# Altium schematic sheet PiModulos V2 - Mayonaise.SchDoc
size B
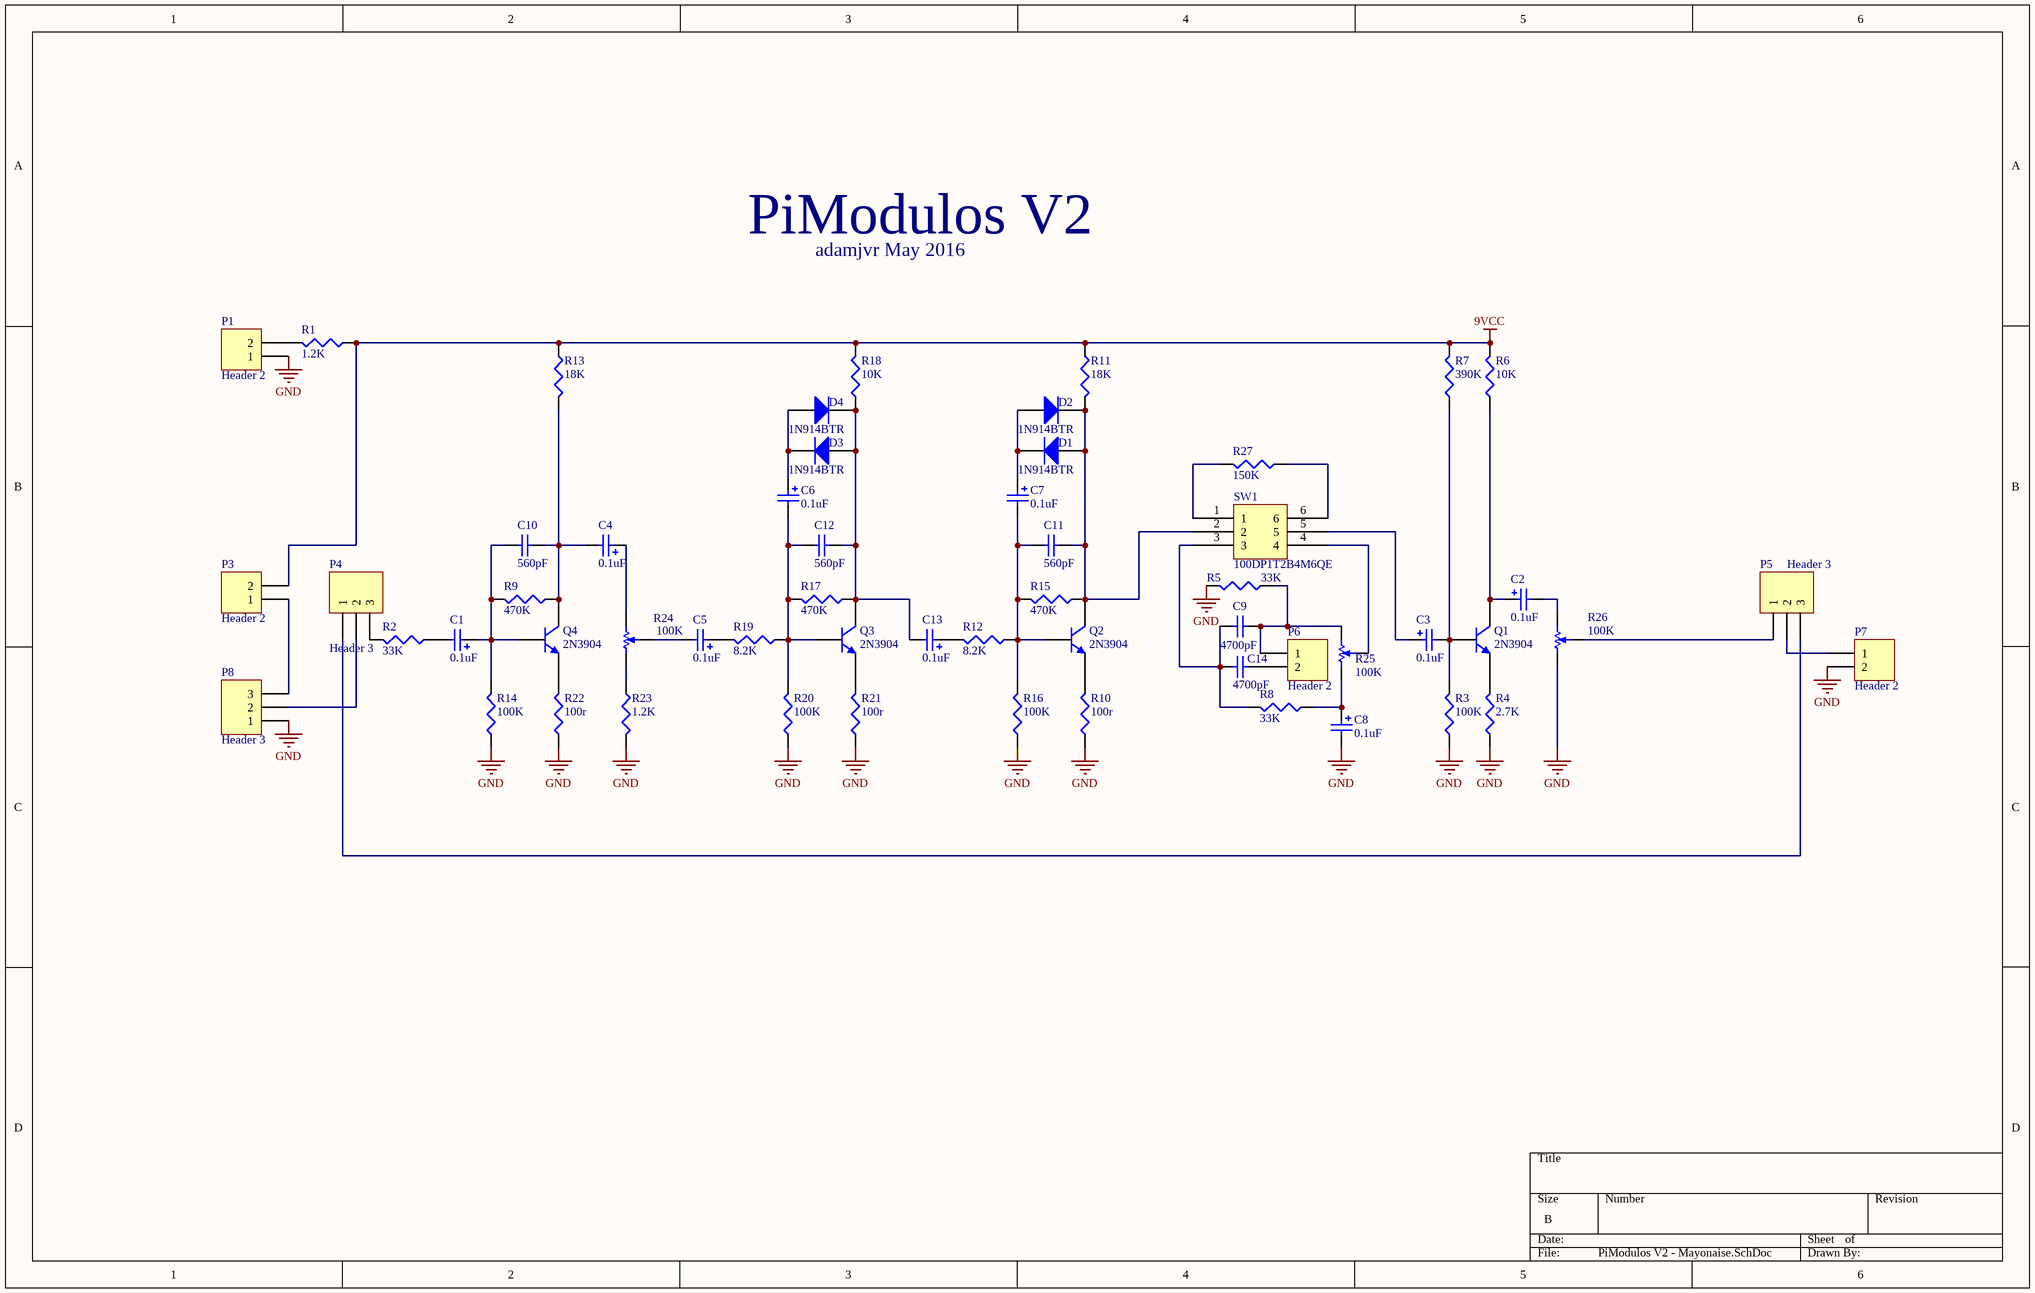
[diagram p0: PiModulos V2 - Mayonaise.SchDoc]

## Parts
C1  0.1uF  [5X12.5mmCAP]
C2  0.1uF  [5X12.5mmCAP]
C3  0.1uF  [5X12.5mmCAP]
C4  0.1uF  [5X12.5mmCAP]
C5  0.1uF  [5X12.5mmCAP]
C6  0.1uF  [5X12.5mmCAP]
C7  0.1uF  [5X12.5mmCAP]
C8  0.1uF  [5X12.5mmCAP]
C9  4700pF  [VY2472M49Y5US63V7]
C10  560pF  [C0805]
C11  560pF  [C0805]
C12  560pF  [C0805]
C13  0.1uF  [5X12.5mmCAP]
C14  4700pF  [VY2472M49Y5US63V7]
D1  1N914BTR  [DO-35]
D2  1N914BTR  [DO-35]
D3  1N914BTR  [DO-35]
D4  1N914BTR  [DO-35]
P1  Header 2  [HDR1X2]
P3  Header 2  [HDR1X2]
P4  Header 3  [HDR1X3]
P5  Header 3  [HDR1X3]
P6  Header 2  [HDR1X2]
P7  Header 2  [HDR1X2]
P8  Header 3  [HDR1X3]
Q1  2N3904  [TO-92A]
Q2  2N3904  [TO-92A]
Q3  2N3904  [TO-92A]
Q4  2N3904  [TO-92A]
R1  1.2K  [R0805]
R2  33K  [R0805]
R3  100K  [R0805]
R4  2.7K  [R0805]
R5  33K  [R0805]
R6  10K  [R0805]
R7  390K  [R0805]
R8  33K  [R0805]
R9  470K  [R0805]
R10  100r  [R0805]
R11  18K  [R0805]
R12  8.2K  [R0805]
R13  18K  [R0805]
R14  100K  [R0805]
R15  470K  [R0805]
R16  100K  [R0805]
R17  470K  [R0805]
R18  10K  [R0805]
R19  8.2K  [R0805]
R20  100K  [R0805]
R21  100r  [R0805]
R22  100r  [R0805]
R23  1.2K  [R0805]
R24  100K  [BOURNS_PTD90SERIES_POT]
R25  100K  [BOURNS_PTD90SERIES_POT]
R26  100K  [BOURNS_PTD90SERIES_POT]
R27  150K  [R0805]
SW1  100DP1T2B4M6QE  [100DP1T2B4M6QE]

## Nets
9VCC: P3.2 R1.1 R6.2 R7.2 R11.1 R13.1 R18.2
GND: C8.2 P1.1 P7.2 P8.1 R3.1 R4.1 R5.2 R10.1 R14.1 R16.1 R20.1 R21.1 R22.1 R23.2 R26.3
NetC1_1: C1.1 C10.2 Q4.2(B) R9.2 R14.2
NetC1_2: C1.2 R2.1
NetC2_1: C2.1 Q1.3(C) R6.1
NetC2_2: C2.2 R26.1
NetC3_1: C3.1 SW1.5
NetC3_2: C3.2 Q1.2(B) R3.2 R7.1
NetC4_1: C4.1 R24.1
NetC4_2: C4.2 C10.1 Q4.3(C) R9.1 R13.2
NetC5_1: C5.1 R19.2
NetC5_2: C5.2 R24.2
NetC6_1: C6.1 D3.2(K) D4.1(A)
NetC6_2: C6.2 C12.2 Q3.2(B) R17.2 R19.1 R20.2
NetC7_1: C7.1 D1.2(K) D2.1(A)
NetC7_2: C7.2 C11.2 Q2.2(B) R12.1 R15.2 R16.2
NetC8_1: C8.1 R8.1 R25.3
NetC9_1: C9.1 P6.1 R5.1 R25.1
NetC9_2: C9.2 C14.2 R8.2 SW1.3
NetC11_1: C11.1 D1.1(A) D2.2(K) Q2.3(C) R11.2 R15.1 SW1.2
NetC12_1: C12.1 C13.2 D3.1(A) D4.2(K) Q3.3(C) R17.1 R18.1
NetC13_1: C13.1 R12.2
NetC14_1: C14.1 P6.2
NetP1_2: P1.2 R1.2
NetP3_1: P3.1 P8.3
NetP4_1: P4.1 P5.3
NetP4_2: P4.2 P8.2
NetP4_3: P4.3 R2.2
NetP5_1: P5.1 R26.2
NetP5_2: P5.2 P7.1
NetQ1_1: Q1.1(E) R4.2
NetQ2_1: Q2.1(E) R10.2
NetQ3_1: Q3.1(E) R21.2
NetQ4_1: Q4.1(E) R22.2
NetR23_1: R23.1 R24.3
NetR25_2: R25.2 SW1.4
NetR27_1: R27.1 SW1.6
NetR27_2: R27.2 SW1.1

## Notes on the sheet
- PiModulos V2
- adamjvr May 2016

## Library data of the parts
C1-C8 C13 = UFG2A0R1MDM1TD: CAP ALUM 0.1UF 20% 100V RADIAL; MFR: Nichicon; Pin Count #: 2; Type: Aluminum Capacitor Throughhole; Lead-Free ?: Yes; Designer: Adam Vadala-Roth; MFR #: UFG2A0R1MDM1TD; Status: Active; Mounting: SMT/SMD; Datasheet: http://nichicon-us.com/english/products/pdfs/e-ufg.pdf; Height: 12.5mm; Tolerance: 20%; Cost: 0.08413 @ @ 1000; Voltage: 100V; Date Created: 9 May 2016; Last Modified: 9 May 2016; Value: 0.1uF
C9 C14 = VY2472M49Y5US63V7: 4700pF ±20% 440VAC Y5U (E) Ceramic Capacitor -40°C ~ 125°C Through Hole Radial, Disc 0.492" Dia (12.50mm); MFR: Vishay-BC-Components; Pin Count #: 2; Type: Ceramic Capacitor Throughole Disc; Lead-Free ?: Yes; Designer: Adam Vadala-Roth; MFR #: VY2472M49Y5US63V7; Status: Active; Mounting: SMT/SMD; Datasheet: http://www.vishay.com/docs/28535/vy2series.pdf; Height: 16.5mm; Tolerance: 20%; Cost: 0.10697 @ 1000; Voltage: 440VAC; Date Created: 10 May 2016; Last Modified: 10 May 2016; Value: 4700pF; Digikey #: BC2359-ND
C10-C12 = CL21C561JBANNNC: 560pF ±5% 50V C0G, NP0 Ceramic Capacitor -55°C ~ 125°C Surface Mount, MLCC 0805 (2012 Metric) 0.079" L x 0.049" W (2.00mm x 1.25mm; MFR: Samsung-Electro-Mechanics-America,-Inc.; Pin Count #: 2; Type: Ceramic Capacitor 0805; Lead-Free ?: Yes; Designer: Adam Vadala-Roth; MFR #: CL21C561JBANNNC; Status: Active; Mounting: SMT/SMD; Datasheet: http://www.samsungsem.com/kr/support/product-search/mlcc/__icsFiles/afieldfile/2015/06/03/CL21C561JBANNNC.pdf; Height: 0.75mm; Tolerance: 5%; Cost: 0.02574; Voltage: 50V; Date Created: 9 May 2016; Last Modified: 9 May 2016; Value: 560pF
D1-D4 = 1N914BTR: DIODE GEN PURP 100V 200MA DO35; MFR: Fairchild-Semiconductor; Pin Count #: 2; Type: Throughhole Diode; Lead-Free ?: Yes; Designer: Adam Vadala-Roth; MFR #: 1N914BTR; Status: Active; Mounting: SMT/SMD; Datasheet: https://www.fairchildsemi.com/datasheets/1N/1N914.pdf; Height: 4mm; Tolerance: N/A; Cost: 0.009 @ 1000; Voltage: 100V; Date Created: 8 May 2016; Last Modified: 8 May 2016; Value: 1N914BTR
P1 P3 P6 P7 = Header 2: Header, 2-Pin; LatestRevisionDate: 17-Jul-2002; LatestRevisionNote: Re-released for DXP Platform.; Publisher: Altium Limited
P4 P5 P8 = Header 3: Header, 3-Pin; LatestRevisionDate: 17-Jul-2002; LatestRevisionNote: Re-released for DXP Platform.; Publisher: Altium Limited
Q1-Q4 = 2N3904TF: TRANS NPN 40V 0.2A TO-92; MFR: Fairchild-Semiconductor; Pin Count #: 2; Type: NPN Transistor; Lead-Free ?: Yes; Designer: Adam Vadala-Roth; MFR #: 2N3904TF; Status: Active; Mounting: SMT/SMD; Datasheet: https://www.fairchildsemi.com/datasheets/MM/MMBT3904.pdf; Height: 5mm; Tolerance: N/A; Cost: 0.03468 @ 2000; Voltage: 40V; Date Created: 9 May 2016; Last Modified: 9 May 2016; Value: 2N3904
R1 R23 = ERJ-6ENF1201V: RES SMD 1.2K OHM 1% 1/8W 0805; MFR: Panasonic-Electronic-Components; Pin Count #: 2; Lead-Free ?: Yes; Designer: Adam Vadala-Roth; MFR #: ERJ-6ENF1201V; Status: Active; Mounting: SMT/SMD; Datasheet: http://industrial.panasonic.com/www-cgi/jvcr13pz.cgi?E+PZ+3+AOA0002+ERJ6ENF1201V+7+WW; Height: 0.7mm; Tolerance: 1%; Cost: 0.00729 @ 1000; Type: Chip Resistor 0805; Voltage: 1/8W; Date Created: 8 May 2016; Last Modified: 8 May 2016; Value: 1.2K
R2 R5 R8 = ERJ-6ENF3302V: RES SMD 33K OHM 1% 1/8W 0805; MFR: Panasonic-Electronic-Components; Pin Count #: 2; Lead-Free ?: Yes; Designer: Adam Vadala-Roth; MFR #: ERJ-6ENF3302V; Status: Active; Mounting: SMT/SMD; Datasheet: http://industrial.panasonic.com/www-cgi/jvcr13pz.cgi?E+PZ+3+AOA0002+ERJ6ENF3302V+7+WW; Height: 0.7mm; Tolerance: 1%; Cost: 0.00729; Type: Chip Resistor 0805; Voltage: 1/8W; Date Created: 9 May 2016; Last Modified: 9 May 2016; Value: 33K
R3 R14 R16 R20 = ERJ-6ENF1003V: RES SMD 100K OHM 1% 1/8W 0805; MFR: Panasonic-Electronic-Components; Pin Count #: 2; Lead-Free ?: Yes; Designer: Adam Vadala-Roth; MFR #: ERJ-6ENF1003V; Status: Active; Mounting: SMT/SMD; Datasheet: http://industrial.panasonic.com/www-cgi/jvcr13pz.cgi?E+PZ+3+AOA0002+ERJ6ENF1003V+7+WW; Height: 0.7mm; Tolerance: 1%; Cost: 0.00729 @ 1000; Type: Chip Resistor; Voltage: 1/8W; Date Created: 9 May 2016; Last Modified: 9 May 2016; Value: 100K
R4 = RC2012F272CS: RES SMD 2.7K OHM 1% 1/8W 0805; MFR: Samsung-Electro-Mechanics-America,-Inc.; Pin Count #: 2; Lead-Free ?: Yes; Designer: Adam Vadala-Roth; MFR #: RC2012F272CS; Status: Active; Mounting: SMT/SMD; Datasheet: https://media.digikey.com/pdf/Data%20Sheets/Samsung%20PDFs/RC_Series_ds.pdf; Height: 0.6mm; Tolerance: 1%; Cost: 0.004080 @ 1000; Type: Chip Resistor 0805; Voltage: 1/8W; Date Created: 8 May 2016; Last Modified: 8 May 2016; Value: 2.7K
R6 R18 = ERJ-6ENF1002V: RES SMD 10K OHM 1% 1/8W 0805; MFR: Panasonic-Electronic-Components; Pin Count #: 2; Lead-Free ?: Yes; Designer: Adam Vadala-Roth; MFR #: ERJ-6ENF1002V; Status: Active; Mounting: SMT/SMD; Datasheet: http://industrial.panasonic.com/www-cgi/jvcr13pz.cgi?E+PZ+3+AOA0002+ERJ6ENF1002V+7+WW; Height: 0.7mm; Tolerance: 1%; Cost: 0.00729 @ 1000; Type: Chip Resistor 0805; Voltage: 1/8W; Date Created: 8 May 2016; Last Modified: 8 May 2016; Value: 10K
R7 = ERJ-6ENF3903V: RES SMD 390K OHM 1% 1/8W 0805; MFR: Panasonic-Electronic-Components; Pin Count #: 2; Lead-Free ?: Yes; Designer: Adam Vadala-Roth; MFR #: ERJ-6ENF3903V; Status: Active; Mounting: SMT/SMD; Datasheet: http://industrial.panasonic.com/www-cgi/jvcr13pz.cgi?E+PZ+3+AOA0002+ERJ6ENF3903V+7+WW; Height: 0.7mm; Tolerance: 1%; Cost: 0.00729 @ 1000; Type: Chip Resistor 0805; Voltage: 1/8W; Date Created: 8 May 2016; Last Modified: 8 May 2016; Value: 390K
R9 R15 R17 = ERJ-6ENF4703V: RES SMD 470K OHM 1% 1/8W 0805; MFR: Panasonic-Electronic-Components; Pin Count #: 2; Lead-Free ?: Yes; Designer: Adam Vadala-Roth; MFR #: ERJ-6ENF4703V; Status: Active; Mounting: SMT/SMD; Datasheet: http://industrial.panasonic.com/www-cgi/jvcr13pz.cgi?E+PZ+3+AOA0002+ERJ6ENF4703V+7+WW; Height: 0.7mm; Tolerance: 1%; Cost: 0.00729	 @ 1000; Type: Chip Resistor 0805; Voltage: 1/8W; Date Created: 9 May 2016; Last Modified: 9 May 2016; Value: 470K
R10 R21 R22 = CRCW0805100RFKEA: RES SMD 100 OHM 1% 1/8W 0805; MFR: Vishay-Dale; Pin Count #: 2; Lead-Free ?: Yes; Designer: Adam Vadala-Roth; MFR #: CRCW0805100RFKEA; Status: Active; Mounting: SMT/SMD; Datasheet: https://www.vishay.com/docs/20035/dcrcwe3.pdf; Height: 0.5mm; Tolerance: 1%; Cost: 0.00729 @ 1000; Type: Chip Resistor 0805; Voltage: 1/8W; Date Created: 9 May 2016; Last Modified: 9 May 2016; Value: 100r
R11 R13 = ERJ-6ENF1802V: RES SMD 18K OHM 1% 1/8W 0805; MFR: Panasonic-Electronic-Components; Pin Count #: 2; Lead-Free ?: Yes; Designer: Adam Vadala-Roth; MFR #: ERJ-6ENF1802V; Status: Active; Mounting: SMT/SMD; Datasheet: http://industrial.panasonic.com/www-cgi/jvcr13pz.cgi?E+PZ+3+AOA0002+ERJ6ENF1802V+7+WW; Height: 0.7mm; Tolerance: 1%; Cost: 0.00729 @ 1000; Type: Chip Resistor 0805; Voltage: 1/8W; Date Created: 8 May 2016; Last Modified: 8 May 2016; Value: 18K
R12 R19 = RC2012F822CS: RES SMD 8.2K OHM 1% 1/8W 0805; MFR: Samsung-Electro-Mechanics-America,-Inc.; Pin Count #: 2; Lead-Free ?: Yes; Designer: Adam Vadala-Roth; MFR #: RC2012F822CS; Status: Active; Mounting: SMT/SMD; Datasheet: https://media.digikey.com/pdf/Data%20Sheets/Samsung%20PDFs/RC_Series_ds.pdf; Height: 0.6mm; Tolerance: 1%; Cost: 0.00408 @ 1000; Type: Chip Resistor; Voltage: 1/8W; Date Created: 9 May 2016; Last Modified: 9 May 2016; Value: 8.2K
R24-R26 = PTD901-2015K-B104: POT 100K OHM 1/20W CARBON LINEAR; MFR: Bourns Inc.; Pin Count #: 3; Tolerance: 20%; Lead-Free ?: Yes; Designer: Adam Vadala-Roth; MFR #: PTD901-2015K-B104; Status: Active; Mounting: Through Hole; Datasheet: http://www.bourns.com/docs/Product-Datasheets/PTD90.pdf; Height: 11mm; Cost: 0.91800	 @ 1000; Type: Throughhole Potentiometer; Voltage: 1/20W; Date Created: 10 May 2016; Last Modified: 10 May 2016; Value: 100K
R27 = RC2012F154CS: RES SMD 150K OHM 1% 1/8W 0805; MFR: Samsung-Electro-Mechanics-America,-Inc.; Pin Count #: 2; Lead-Free ?: Yes; Designer: Adam Vadala-Roth; MFR #: RC2012F154CS; Status: Active; Mounting: SMT/SMD; Datasheet: https://media.digikey.com/pdf/Data%20Sheets/Samsung%20PDFs/RC_Series_ds.pdf; Height: 0.6mm; Tolerance: 1%; Cost: 0.00408 @ 10000; Type: Chip Resistor; Voltage: 1/8W; Date Created: 8 May 2016; Last Modified: 8 May 2016; Value: 150K
SW1 = 100DP1T2B4M6QE: SWITCH TOGGLE DPDT 5A 120V; MFR: E-Switch; Pin Count #: 6; Lead-Free ?: Yes; Designer: Adam Vadala-Roth; MFR #: 100DP1T2B4M6QE; Status: Active; Mounting: Through Hole; Datasheet: http://spec_sheets.e-switch.com/specs/T121043.pdf; Height: 11.43; Tolerance: N/A; Cost: 2.12800 @ 1000; Type: DPDT Toggle Switch 120V; Voltage: 120V; Date Created: 10 May 2016; Last Modified: 10 May 2016; Value: 100DP1T2B4M6QE